# EAGLE design box (EAGLE 7.5.0)
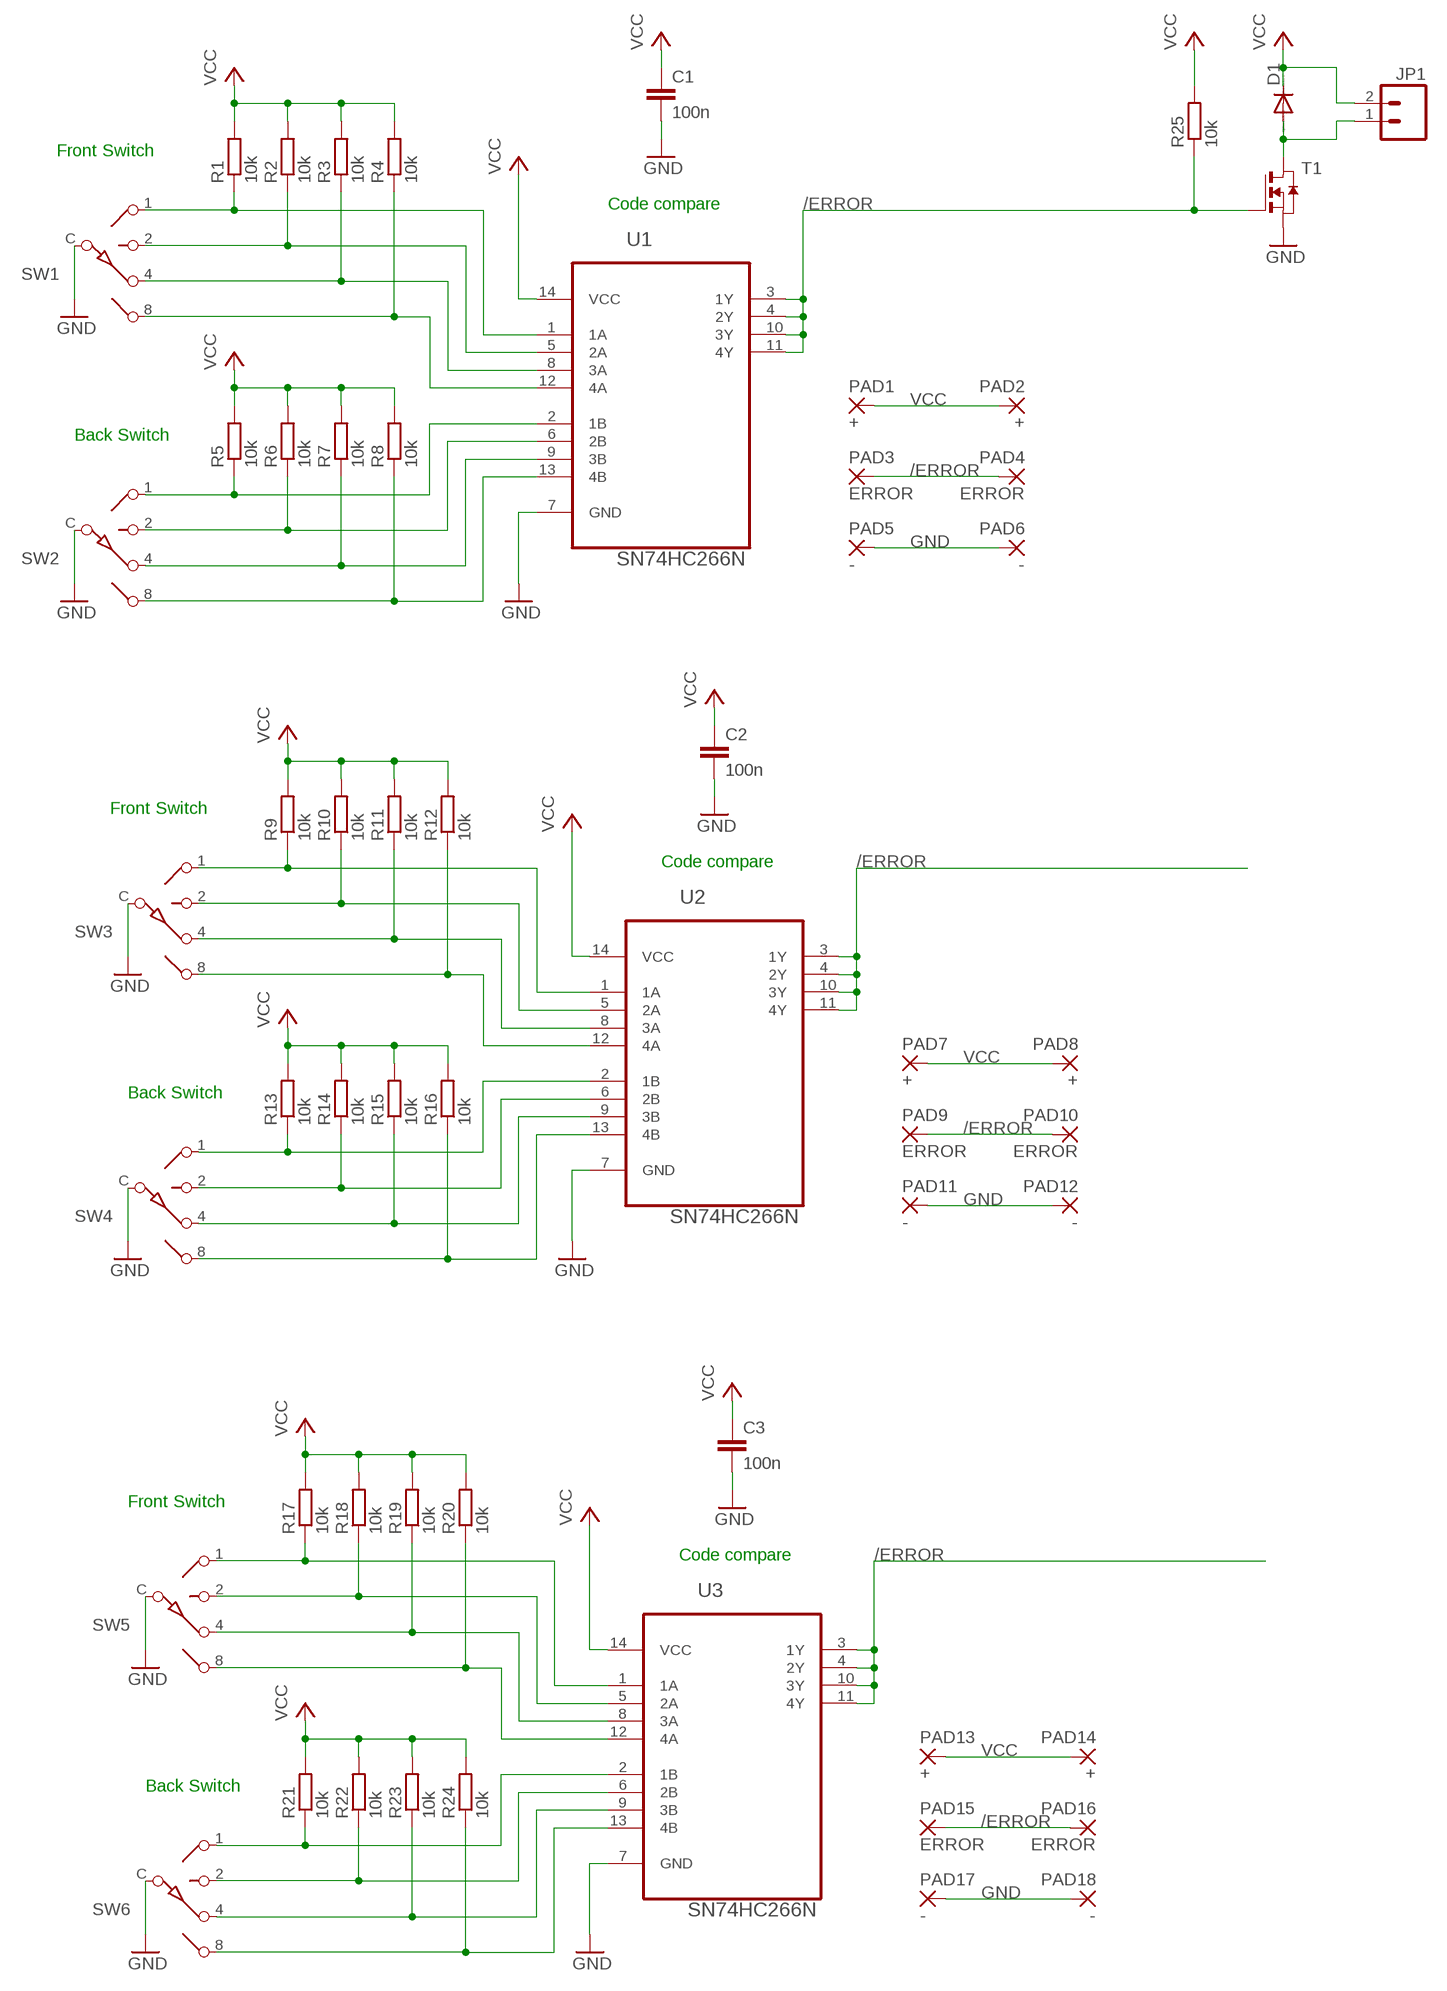
[diagram p0: schematic, sheet 1]

## Parts
C1  100n  C-EUC0805  [C0805]
C2  100n  C-EUC0805  [C0805]
C3  100n  C-EUC0805  [C0805]
D1  DIODE-DO41-7.6  [DO41-7.6]
JP1  M02JST-PTH-2  [JST-2-PTH]
PAD1  +  2,15/1,0  [2,15/1,0]
PAD2  +  2,15/1,0  [2,15/1,0]
PAD3  ERROR  2,15/1,0  [2,15/1,0]
PAD4  ERROR  2,15/1,0  [2,15/1,0]
PAD5  -  2,15/1,0  [2,15/1,0]
PAD6  -  2,15/1,0  [2,15/1,0]
PAD7  +  2,15/1,0  [2,15/1,0]
PAD8  +  2,15/1,0  [2,15/1,0]
PAD9  ERROR  2,15/1,0  [2,15/1,0]
PAD10  ERROR  2,15/1,0  [2,15/1,0]
PAD11  -  2,15/1,0  [2,15/1,0]
PAD12  -  2,15/1,0  [2,15/1,0]
PAD13  +  2,15/1,0  [2,15/1,0]
PAD14  +  2,15/1,0  [2,15/1,0]
PAD15  ERROR  2,15/1,0  [2,15/1,0]
PAD16  ERROR  2,15/1,0  [2,15/1,0]
PAD17  -  2,15/1,0  [2,15/1,0]
PAD18  -  2,15/1,0  [2,15/1,0]
R1  10k  R-EU_R0805  [R0805]
R2  10k  R-EU_R0805  [R0805]
R3  10k  R-EU_R0805  [R0805]
R4  10k  R-EU_R0805  [R0805]
R5  10k  R-EU_R0805  [R0805]
R6  10k  R-EU_R0805  [R0805]
R7  10k  R-EU_R0805  [R0805]
R8  10k  R-EU_R0805  [R0805]
R9  10k  R-EU_R0805  [R0805]
R10  10k  R-EU_R0805  [R0805]
R11  10k  R-EU_R0805  [R0805]
R12  10k  R-EU_R0805  [R0805]
R13  10k  R-EU_R0805  [R0805]
R14  10k  R-EU_R0805  [R0805]
R15  10k  R-EU_R0805  [R0805]
R16  10k  R-EU_R0805  [R0805]
R17  10k  R-EU_R0805  [R0805]
R18  10k  R-EU_R0805  [R0805]
R19  10k  R-EU_R0805  [R0805]
R20  10k  R-EU_R0805  [R0805]
R21  10k  R-EU_R0805  [R0805]
R22  10k  R-EU_R0805  [R0805]
R23  10k  R-EU_R0805  [R0805]
R24  10k  R-EU_R0805  [R0805]
R25  10k  R-EU_R0805  [R0805]
SW1  ROTARY-SWITCH-10POSMCRM4HAF-10R-V-B  [MCRM4HAF]
SW2  ROTARY-SWITCH-10POSMCRM4HAF-10R-V-B  [MCRM4HAF]
SW3  ROTARY-SWITCH-10POSMCRM4HAF-10R-V-B  [MCRM4HAF]
SW4  ROTARY-SWITCH-10POSMCRM4HAF-10R-V-B  [MCRM4HAF]
SW5  ROTARY-SWITCH-10POSMCRM4HAF-10R-V-B  [MCRM4HAF]
SW6  ROTARY-SWITCH-10POSMCRM4HAF-10R-V-B  [MCRM4HAF]
T1  TSM3442  [SOT23-6]
U1  SN74HC266N  [DIP254P762X508-14]
U2  SN74HC266N  [DIP254P762X508-14]
U3  SN74HC266N  [DIP254P762X508-14]

## Nets
/ERROR: PAD3.1(P) PAD4.1(P) PAD9.1(P) PAD10.1(P) PAD15.1(P) PAD16.1(P) R25.1 T1.3(G) U1.3(1Y) U1.4(2Y) U1.10(3Y) U1.11(4Y) U2.3(1Y) U2.4(2Y) U2.10(3Y) U2.11(4Y) U3.3(1Y) U3.4(2Y) U3.10(3Y) U3.11(4Y)
GND: C1.2 C2.2 C3.2 PAD5.1(P) PAD6.1(P) PAD11.1(P) PAD12.1(P) PAD17.1(P) PAD18.1(P) SW1.C SW2.C SW3.C SW4.C SW5.C SW6.C T1.4(S) U1.7(GND) U2.7(GND) U3.7(GND)
N$1: R1.1 SW1.1 U1.1(1A)
N$2: R2.1 SW1.2 U1.5(2A)
N$3: R3.1 SW1.4 U1.8(3A)
N$4: R4.1 SW1.8 U1.12(4A)
N$5: D1.A JP1.1 T1.1(D) T1.2(D) T1.5(D) T1.6(D)
N$6: R5.1 SW2.1 U1.2(1B)
N$7: R6.1 SW2.2 U1.6(2B)
N$8: R7.1 SW2.4 U1.9(3B)
N$9: R8.1 SW2.8 U1.13(4B)
N$10: R9.1 SW3.1 U2.1(1A)
N$11: R10.1 SW3.2 U2.5(2A)
N$12: R11.1 SW3.4 U2.8(3A)
N$13: R12.1 SW3.8 U2.12(4A)
N$14: R13.1 SW4.1 U2.2(1B)
N$15: R14.1 SW4.2 U2.6(2B)
N$16: R15.1 SW4.4 U2.9(3B)
N$17: R16.1 SW4.8 U2.13(4B)
N$18: R17.1 SW5.1 U3.1(1A)
N$19: R18.1 SW5.2 U3.5(2A)
N$20: R19.1 SW5.4 U3.8(3A)
N$21: R20.1 SW5.8 U3.12(4A)
N$22: R21.1 SW6.1 U3.2(1B)
N$23: R22.1 SW6.2 U3.6(2B)
N$24: R23.1 SW6.4 U3.9(3B)
N$26: R24.1 SW6.8 U3.13(4B)
VCC: C1.1 C2.1 C3.1 D1.C JP1.2 PAD1.1(P) PAD2.1(P) PAD7.1(P) PAD8.1(P) PAD13.1(P) PAD14.1(P) R1.2 R2.2 R3.2 R4.2 R5.2 R6.2 R7.2 R8.2 R9.2 R10.2 R11.2 R12.2 R13.2 R14.2 R15.2 R16.2 R17.2 R18.2 R19.2 R20.2 R21.2 R22.2 R23.2 R24.2 R25.2 U1.14(VCC) U2.14(VCC) U3.14(VCC)

## Notes on the sheet
- Front Switch
- Code compare
- Back Switch
- Front Switch
- Code compare
- Back Switch
- Front Switch
- Code compare
- Back Switch

## Library data of the parts
C1-C3 = rcl:C-EU: CAPACITOR, European symbol
D1 = diode:DIODE-: DIODE
JP1 = SparkFun-Connectors:M02: Standard 2-pin 0.1" header. Use with - straight break away headers ( PRT-00116) - right angle break away headers (PRT-00553) - swiss pins (PRT-00743) - machine pins (PRT-00117) - female headers (PRT-00115) Molex polarized connector foot print use with: PRT-08233 with associated crimp pins and housings. 2.54_SCREWTERM for use with PRT-10571. 3.5mm Screw Terminal footprints for PRT-08084 5mm Screw Terminal footprints for use with PRT-08432; PROD_ID: CONN-09863; SKU: PRT-09914
PAD1-PAD18 = wirepad:2,15/1,0: THROUGH-HOLE PAD
R1-R25 = resistor:R-EU_: RESISTOR, European symbol
SW1-SW6 = fabBox:ROTARY-SWITCH-10POS: SWITCH 10-step rotary switch
T1 = fabBox:TSM3442: 20V N-Channel MOSFET 4A Farnell <http://ch.farnell.com/fr-CH/taiwan-semiconductor/tsm3442cx6/mosfet-n-ch-20v-4a-sot26/dp/1864591>; OC_FARNELL: unknown; OC_NEWARK: unknown
U1-U3 = fabBox:SN74HC266N: QUAD 2-IN EXCLUSIVE -NOR GATES; MPN: SN74HC266N; OC_FARNELL: 1607817; OC_NEWARK: 08F6495; PACKAGE: 14-DIP; SUPPLIER: Texas Instruments

## Board
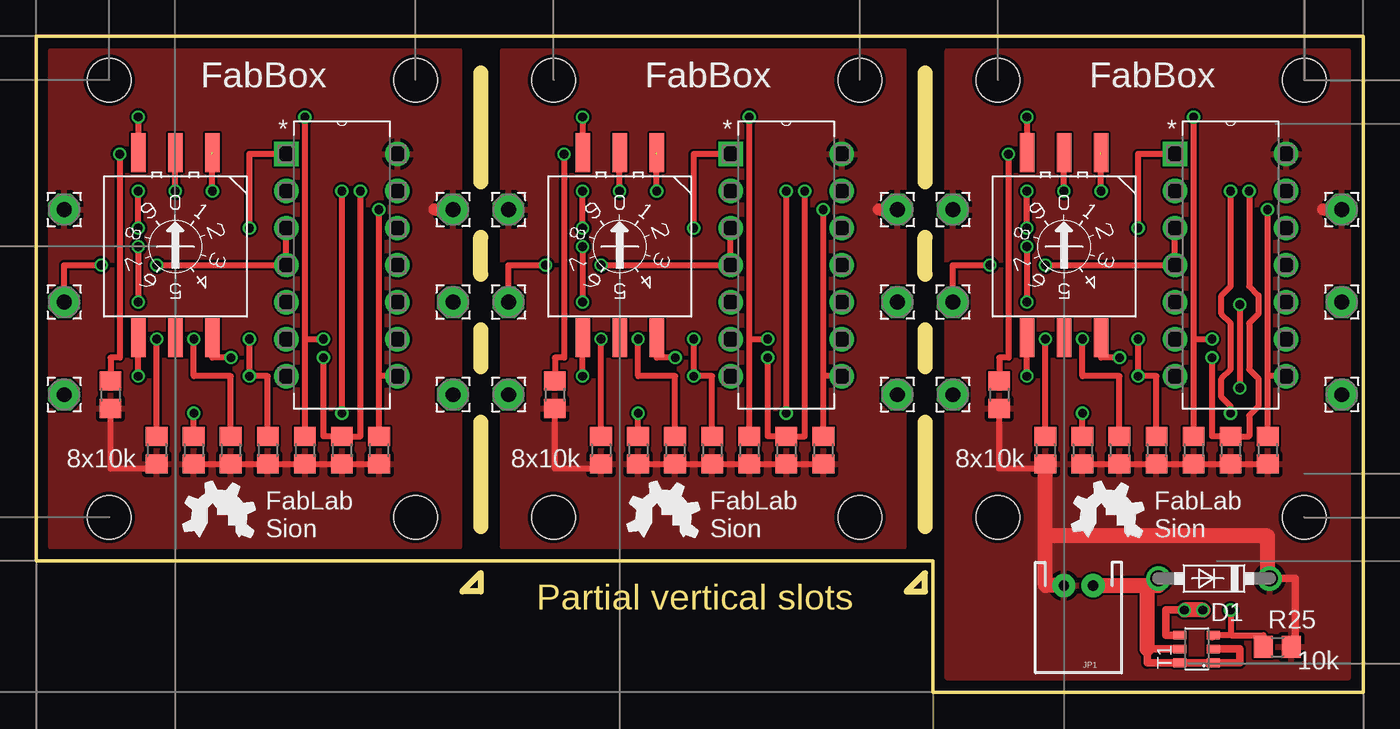
[diagram p1: board, top side]
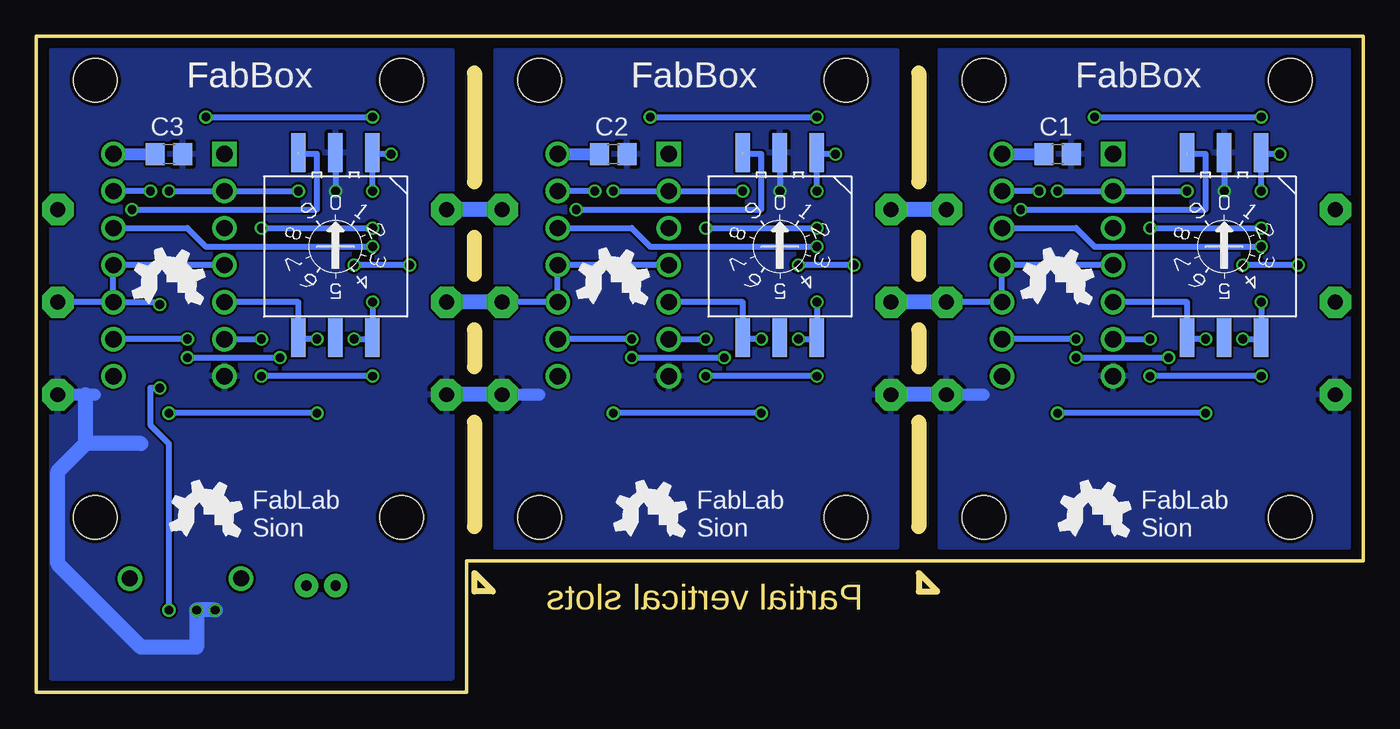
[diagram p2: board, bottom side, seen from below]

Size 91 x 45 mm. Coordinates in mm from the lower left corner, seen from the top.
Outline: 91,0 91,45 0,45 0,9 61.5,9 61.5,0 91,0
Copper layers (1*16): Top 0.035mm / dielectric 1.5mm / Bottom 0.035mm
Design rules "SeeedStudio_2layer_DRU_no_angle_20140221": minimum track width 6mil, minimum drill 12mil, track to track 6mil, track to pad 6mil, pad to pad 6mil, via to via 6mil, smd to smd 0mil, copper to edge 10mil, drill to drill 10mil, minimum pad ring 10mil, minimum via ring 6mil, stop-mask expansion 2mil, vias tented up to drill 100mil, thermal gap 10mil
Holes 3 mm at 5,42 26,42 26,12 5,12 35.48,42 56.48,42 56.48,12 35.48,12 65.96,42 86.96,42 86.96,12 65.96,12
Milling: 14 lines

### Footprints (pad centres in the part's own frame; a part is rotated, then mirrored left to right if it is on the bottom)
C0805 = smd 1.3 x 1.5: 1 -0.95,0; 2 0.95,0
DO41-7.6 = drill 1.1 pad 1.7: A 3.81,0; C -3.81,0
JST-2-PTH = drill 0.7 pad 1.6: 1 -1,0; 2 1,0
2,15/1,0 = drill 1.016 pad 2.159 octagon: 1 0,0
R0805 = smd 1.3 x 1.5: 1 -0.95,0; 2 0.95,0
MCRM4HAF = smd 2.692 x 1.001: 1 6.447,-2.54; 2 -6.246,2.54; 4 6.447,2.54; 8 -6.246,-2.54; C 6.447,0; NC -6.246,0
SOT23-6 = smd 0.6 x 0.9: 1 -0.95,-1.15; 2 0,-1.15; 3 0.95,-1.15; 4 0.95,1.15; 5 0,1.15; 6 -0.95,1.15
DIP254P762X508-14 = drill 1.118 square: 1 -7.62,15.24 | drill 1.118: 2 -7.62,12.7; 3 -7.62,10.16; 4 -7.62,7.62; 5 -7.62,5.08; 6 -7.62,2.54; 7 -7.62,0; 8 0,0; 9 0,2.54; 10 0,5.08; 11 0,7.62; 12 0,10.16; 13 0,12.7; 14 0,15.24

### Placement (x,y rotation side)
C1  20.95,36.93 0 bottom
C2  51.44,36.93 0 bottom
C3  81.92,36.93 0 bottom
D1  80.78,7.8 180 top
E$1  [LOGO_200]  23.5,26 0 bottom
E$2  [LOGO_200_TEXT]  10,10 0 top
E$3  [LOGO_200]  53.98,26 0 bottom
E$4  [LOGO_200_TEXT]  40.48,10 0 top
E$5  [LOGO_200]  84.46,26 0 bottom
E$6  [LOGO_200_TEXT]  70.96,10 0 top
JP1  71.48,7.32 180 top
PAD1  1.91,33.12 0 top
PAD2  28.57,33.12 0 top
PAD3  1.91,26.77 0 top
PAD4  28.57,26.77 0 top
PAD5  28.57,20.42 0 top
PAD6  1.91,20.42 0 top
PAD7  32.38,33.12 0 top
PAD8  59.05,33.12 0 top
PAD9  32.38,26.77 0 top
PAD10  59.05,26.77 0 top
PAD11  59.05,20.42 0 top
PAD12  32.38,20.42 0 top
PAD13  62.87,33.12 0 top
PAD14  89.53,33.12 0 top
PAD15  62.87,26.77 0 top
PAD16  89.53,26.77 0 top
PAD17  89.53,20.42 0 top
PAD18  62.87,20.42 0 top
R1  5.08,20.42 270 top
R2  13.34,16.61 270 top
R3  23.5,16.61 270 top
R4  8.26,16.61 270 top
R5  10.79,16.61 270 top
R6  15.88,16.61 270 top
R7  18.41,16.61 270 top
R8  20.95,16.61 270 top
R9  35.56,20.42 270 top
R10  43.81,16.61 270 top
R11  53.98,16.61 270 top
R12  38.73,16.61 270 top
R13  41.27,16.61 270 top
R14  46.35,16.61 270 top
R15  48.9,16.61 270 top
R16  51.44,16.61 270 top
R17  66.04,20.42 270 top
R18  74.3,16.61 270 top
R19  84.45,16.61 270 top
R20  69.22,16.61 270 top
R21  71.75,16.61 270 top
R22  76.83,16.61 270 top
R23  79.38,16.61 270 top
R24  81.92,16.61 270 top
R25  85.12,3.11 0 top
SW1  9.53,30.58 90 bottom
SW2  9.53,30.58 90 top
SW3  40.01,30.58 90 bottom
SW4  40.01,30.58 90 top
SW5  70.48,30.58 90 bottom
SW6  70.48,30.58 90 top
T1  79.59,2.97 90 top
U1  24.77,21.69 0 top
U2  55.24,21.69 0 top
U3  85.72,21.69 0 top
U$1  [LOGO_200_TEXT]  20.95,10.05 0 bottom
U$2  [LOGO_200_TEXT]  51.42,10.05 0 bottom
U$3  [LOGO_200_TEXT]  81.91,10.05 0 bottom

### Tracks (layer width: path | path; a pad name or v marks a point on that pad's centre or on a via)
/ERROR  (via drill 0.6)
  Top 0.406: U1.3 U1.4 v8.26,29.31 | PAD3.1 1.91,29.31 v4.45,29.31 | U2.3 U2.4 v38.73,29.31 | PAD9.1 32.38,29.31 v34.92,29.31 | U3.3 U3.4 v69.22,29.31 | PAD15.1 62.87,29.31 v65.41,29.31 | v82.55,26.59 v82.55,20.88 | T1.3 80.83,3.92 | 81.92,3.92 84.17,3.92 R25.1 | v81.92,5.64 81.92,3.92 | 81.92,3.92 80.83,3.92 | 80.83,3.92 80.64,3.73
  Bottom 0.406: U1.4 U1.11 U1.10 PAD4.1 | v4.45,29.31 v8.26,29.31 | U2.4 U2.11 U2.10 PAD10.1 | v34.92,29.31 v38.73,29.31 | U3.10 U3.11 U3.4 | U3.10 PAD16.1 | v65.41,29.31 v69.22,29.31 | U3.10 82.55,26.77 v82.55,26.59 | v82.55,20.88 83.19,20.88 83.19,18.34 81.92,17.07 v81.92,5.64
  Bottom 1.016: PAD4.1 PAD9.1 | PAD10.1 PAD15.1
GND  (via drill 0.6)
  Top 0.406: v9.53,34.39 SW2.C | v40.01,34.39 SW4.C | v70.48,34.39 SW6.C
  Top 0.508: T1.4 77.47,3.92 77.47,5.64 v78.74,5.64
  Top 1.016: v80.01,5.64 v78.74,5.64
  Bottom 0.406: SW2.C v9.53,34.39 | SW4.C v40.01,34.39 | SW6.C v70.48,34.39
  Bottom 0.813: PAD5.1 26.04,20.42 | PAD11.1 56.52,20.42 | PAD17.1 87.63,20.42 87,20.42
  Bottom 1.016: PAD5.1 PAD12.1 | PAD11.1 PAD18.1 | v78.74,5.64 v80.01,5.64 80.01,3.1 83.82,3.1 89.53,8.81 89.53,15.16 87.63,17.07 | 83.82,17.07 87.63,17.07 | 87.63,17.07 87.63,20.42
  pour Bottom: 1,44 29,44 29,10 1,10
  pour Bottom: 32,44 59.48,44 59.48,10 32,10
  pour Bottom: 62.5,44 89.96,44 89.96,1 62.5,1
N$1  (via drill 0.6)
  Top 0.406: U1.1 14.61,36.93 v14.61,31.85 | v6.99,31.85 v6.99,34.39 | v5.71,36.93 5.71,22.96 5.08,22.96 R1.1
  Bottom 0.406: v5.71,36.93 6.99,36.93 SW1.1 v6.99,34.39 | v14.61,31.85 v6.99,31.85
N$2  (via drill 0.6)
  Top 0.406: R2.1 13.34,21.69 10.79,21.69 v10.79,24.23
  Bottom 0.406: U1.5 12.06,26.77 SW1.2 12.06,24.23 v10.79,24.23
N$3  (via drill 0.6)
  Top 0.406: R3.1 23.5,21.69 | U1.8 23.5,21.69 | 23.5,21.69 v23.5,33.12
  Bottom 0.406: v23.5,33.12 10.79,33.12 10.79,36.93 11.97,36.93 SW1.4
N$4  (via drill 0.6)
  Top 0.406: v6.99,30.58 v6.99,26.77 | R4.1 v8.26,24.23
  Bottom 0.406: U1.12 19.68,31.85 18.41,30.58 v6.99,30.58 | v6.99,26.77 SW1.8 7.09,24.23 v8.26,24.23
N$5
  Top 0.508: T1.5 76.2,2.97 76.2,2.02 T1.6 T1.1 82.55,2.02 82.55,2.97 T1.2
  Top 1.016: JP1.1 76.2,7.32 | 76.2,7.32 76.97,7.32 D1.A | 76.2,2.97 76.2,7.32
N$6  (via drill 0.6)  (1 unrouted)
  Top 0.406: R5.1 v10.79,19.15 | v12.06,34.39 12.06,36.93 | v20.95,19.15 v20.95,34.39
  Bottom 0.406: v10.79,19.15 v20.95,19.15 | v20.95,34.39 U1.2 v12.06,34.39
N$7  (via drill 0.6)
  Top 0.406: v14.61,24.23 v14.61,21.69 15.88,21.69 R6.1 | v6.99,21.69 SW2.2
  Bottom 0.406: U1.6 v14.61,24.23 | v6.99,21.69 v14.61,21.69
N$8  (via drill 0.6)
  Top 0.406: R7.1 18.41,24.23 | 18.41,24.23 v19.68,24.23 | 18.41,24.23 v18.41,39.47 | v6.99,39.47 SW2.4
  Bottom 0.406: v19.68,24.23 U1.9 | v18.41,39.47 v6.99,39.47
N$9  (via drill 0.6)
  Top 0.406: v13.34,22.96 12.06,22.96 SW2.8 | v22.23,34.39 22.23,17.56 R8.1 19.68,17.56 v19.68,22.96
  Bottom 0.406: v22.23,34.39 U1.13 | v19.68,22.96 v13.34,22.96
N$10  (via drill 0.6)
  Top 0.406: U2.1 45.09,36.93 v45.09,31.85 | v37.47,31.85 v37.47,34.39 | v36.2,36.93 36.2,22.96 35.56,22.96 R9.1
  Bottom 0.406: v36.2,36.93 37.47,36.93 SW3.1 v37.47,34.39 | v45.09,31.85 v37.47,31.85
N$11  (via drill 0.6)
  Top 0.406: R10.1 43.81,21.69 41.27,21.69 v41.27,24.23
  Bottom 0.406: U2.5 42.55,26.77 SW3.2 42.55,24.23 v41.27,24.23
N$12  (via drill 0.6)
  Top 0.406: R11.1 53.98,21.69 | U2.8 53.98,21.69 | 53.98,21.69 v53.98,33.12
  Bottom 0.406: v53.98,33.12 41.27,33.12 41.27,36.93 42.45,36.93 SW3.4
N$13  (via drill 0.6)
  Top 0.406: v37.47,30.58 v37.47,26.77 | R12.1 v38.73,24.23
  Bottom 0.406: U2.12 50.16,31.85 48.9,30.58 v37.47,30.58 | v37.47,26.77 SW3.8 37.57,24.23 v38.73,24.23
N$14  (via drill 0.6)  (1 unrouted)
  Top 0.406: R13.1 v41.27,19.15 | v42.55,34.39 42.55,36.93 | v51.44,19.15 v51.44,34.39
  Bottom 0.406: v41.27,19.15 v51.44,19.15 | v51.44,34.39 U2.2 v42.55,34.39
N$15  (via drill 0.6)
  Top 0.406: v45.09,24.23 v45.09,21.69 46.35,21.69 R14.1 | v37.47,21.69 SW4.2
  Bottom 0.406: U2.6 v45.09,24.23 | v37.47,21.69 v45.09,21.69
N$16  (via drill 0.6)
  Top 0.406: R15.1 48.9,24.23 | 48.9,24.23 v50.16,24.23 | 48.9,24.23 v48.9,39.47 | v37.47,39.47 SW4.4
  Bottom 0.406: v50.16,24.23 U2.9 | v48.9,39.47 v37.47,39.47
N$17  (via drill 0.6)
  Top 0.406: v43.81,22.96 42.55,22.96 SW4.8 | v52.7,34.39 52.7,17.56 R16.1 50.16,17.56 v50.16,22.96
  Bottom 0.406: v52.7,34.39 U2.13 | v50.16,22.96 v43.81,22.96
N$18  (via drill 0.6)
  Top 0.406: U3.1 75.56,36.93 v75.56,31.85 | v67.94,31.85 v67.94,34.39 | v66.67,36.93 66.67,22.96 66.04,22.96 R17.1
  Bottom 0.406: v66.67,36.93 67.94,36.93 SW5.1 v67.94,34.39 | v75.56,31.85 v67.94,31.85
N$19  (via drill 0.6)
  Top 0.406: R18.1 74.3,21.69 71.75,21.69 v71.75,24.23
  Bottom 0.406: U3.5 73.03,26.77 SW5.2 73.03,24.23 v71.75,24.23
N$20  (via drill 0.6)
  Top 0.406: R19.1 84.45,21.69 | U3.8 84.45,21.69 | 84.45,21.69 v84.45,33.12
  Bottom 0.406: v84.45,33.12 71.75,33.12 71.75,36.93 72.93,36.93 SW5.4
N$21  (via drill 0.6)
  Top 0.406: v67.94,30.58 v67.94,26.77 | R20.1 v69.22,24.23
  Bottom 0.406: U3.12 80.64,31.85 79.38,30.58 v67.94,30.58 | v67.94,26.77 SW5.8 68.05,24.23 v69.22,24.23
N$22  (via drill 0.6)  (1 unrouted)
  Top 0.406: R21.1 v71.75,19.15 | v73.03,34.39 73.03,36.93 | v81.92,19.15 81.92,19.61 81.28,20.24 81.28,21.52 81.92,22.15 81.92,25.33 81.28,25.96 81.28,27.23 81.92,27.87 v81.92,34.39
  Bottom 0.406: v71.75,19.15 v81.92,19.15 | v81.92,34.39 U3.2 v73.03,34.39
N$23  (via drill 0.6)
  Top 0.406: v75.56,24.23 v75.56,21.69 76.83,21.69 R22.1 | v67.94,21.69 SW6.2
  Bottom 0.406: U3.6 v75.56,24.23 | v67.94,21.69 v75.56,21.69
N$24  (via drill 0.6)
  Top 0.406: R23.1 79.38,24.23 | 79.38,24.23 v80.64,24.23 | 79.38,24.23 v79.38,39.47 | v67.94,39.47 SW6.4
  Bottom 0.406: v80.64,24.23 U3.9 | v79.38,39.47 v67.94,39.47
N$26  (via drill 0.6)
  Top 0.406: v74.3,22.96 73.03,22.96 SW6.8 | v80.64,22.96 80.64,17.56 R24.1 83.19,17.56 83.19,18.98 83.82,19.61 83.82,21.52 83.19,22.15 83.19,25.33 83.82,25.96 83.82,27.23 83.19,27.87 v83.19,34.39
  Bottom 0.406: v83.19,34.39 U3.13 | v80.64,22.96 v74.3,22.96
VCC
  Top 0.406: R5.2 R6.2 R7.2 R8.2 R3.2 | R4.2 8.26,15.34 5.08,15.34 R1.2 | R13.2 R14.2 R15.2 R16.2 R11.2 | R12.2 38.73,15.34 35.56,15.34 R9.2 | R21.2 R22.2 R23.2 R24.2 R19.2 | R20.2 69.22,15.34 66.04,15.34 R17.2
  Top 0.508: R25.2 86.36,3.11 86.36,7.8 D1.C
  Top 0.813: 27.3,33.12 PAD2.1 | 57.78,33.12 PAD8.1 | 88.27,33.12 PAD14.1
  Top 1.016: JP1.2 69.22,7.32 69.22,10.72 | 69.22,10.72 R20.2 | D1.C 84.45,7.8 84.45,10.72 69.22,10.72
  Bottom 0.813: U1.14 C1.1 | U2.14 C2.1 | U3.14 C3.1
  Bottom 1.016: PAD2.1 PAD7.1 | PAD8.1 PAD13.1
  pour Top: 1,44 29,44 29,10 1,10
  pour Top: 32,44 59.48,44 59.48,10 32,10
  pour Top: 62.5,44 89.96,44 89.96,1 62.5,1
(copper drawn outside any net)
  shapes: Bottom area x1

### Text on the board
bOrigins: 100n | 100n | 100n
tNames: FabBox | FabBox | FabBox | 8x10k | 8x10k | 8x10k
bNames: FabBox | FabBox | FabBox
Milling: Partial vertical slots